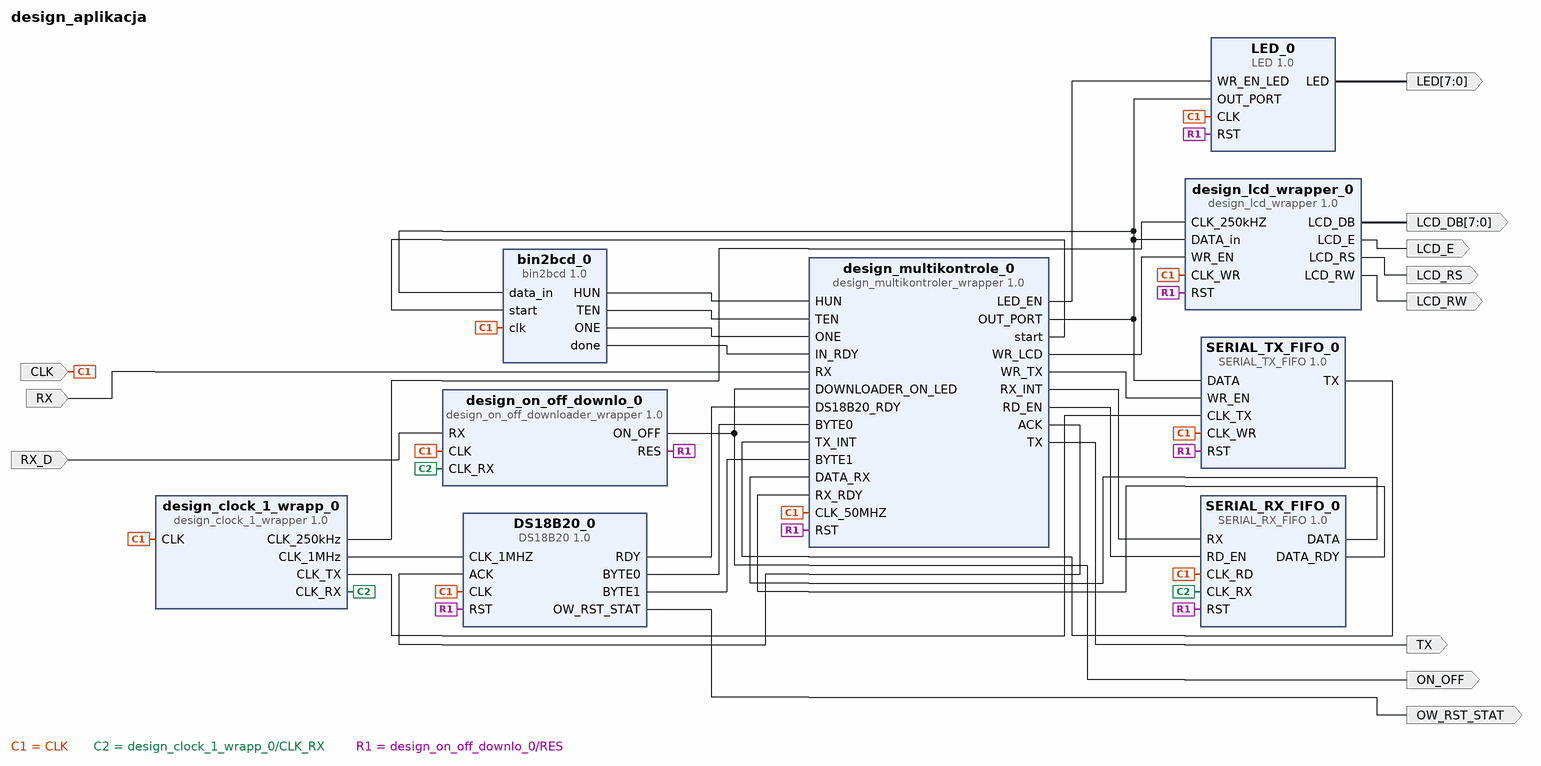
[diagram p0: block diagram of the top level]
# Vivado block design design_aplikacja, xc7z020clg400-2, Vivado 2019.1
create_bd_design design_aplikacja

create_bd_port -dir O -from 7 -to 0 LED
create_bd_port -dir I -type clk CLK
set_property -dict {CONFIG.FREQ_HZ 50000000} [get_bd_ports CLK]
create_bd_port -dir O ON_OFF
create_bd_port -dir O TX
create_bd_port -dir I RX
create_bd_port -dir I RX_D
create_bd_port -dir O -from 7 -to 0 LCD_DB
create_bd_port -dir O LCD_E
create_bd_port -dir O LCD_RS
create_bd_port -dir O LCD_RW
create_bd_port -dir O OW_RST_STAT

create_bd_cell -type ip -vlnv xilinx.com:user:design_multikontroler_wrapper:1.0 design_multikontrole_0
create_bd_cell -type ip -vlnv xilinx.com:user:design_on_off_downloader_wrapper:1.0 design_on_off_downlo_0
create_bd_cell -type ip -vlnv xilinx.com:user:bin2bcd:1.0 bin2bcd_0
create_bd_cell -type ip -vlnv xilinx.com:user:SERIAL_RX_FIFO:1.0 SERIAL_RX_FIFO_0
create_bd_cell -type ip -vlnv xilinx.com:user:SERIAL_TX_FIFO:1.0 SERIAL_TX_FIFO_0
create_bd_cell -type ip -vlnv xilinx.com:user:LED:1.0 LED_0
create_bd_cell -type ip -vlnv xilinx.com:user:design_clock_1_wrapper:1.0 design_clock_1_wrapp_0
create_bd_cell -type ip -vlnv xilinx.com:user:DS18B20:1.0 DS18B20_0
create_bd_cell -type ip -vlnv xilinx.com:user:design_lcd_wrapper:1.0 design_lcd_wrapper_0

# ---- connections ----

connect_bd_net [get_bd_pins bin2bcd_0/HUN] [get_bd_pins design_multikontrole_0/HUN]
connect_bd_net [get_bd_pins bin2bcd_0/TEN] [get_bd_pins design_multikontrole_0/TEN]
connect_bd_net [get_bd_pins bin2bcd_0/ONE] [get_bd_pins design_multikontrole_0/ONE]
connect_bd_net [get_bd_pins LED_0/LED] [get_bd_ports LED]
connect_bd_net -net CLK_0_1 [get_bd_ports CLK] \
  [get_bd_pins bin2bcd_0/clk] [get_bd_pins SERIAL_RX_FIFO_0/CLK_RD] [get_bd_pins design_multikontrole_0/CLK_50MHZ] \
  [get_bd_pins LED_0/CLK] [get_bd_pins design_on_off_downlo_0/CLK] [get_bd_pins SERIAL_TX_FIFO_0/CLK_WR] \
  [get_bd_pins design_clock_1_wrapp_0/CLK] [get_bd_pins DS18B20_0/CLK] [get_bd_pins design_lcd_wrapper_0/CLK_WR]
connect_bd_net [get_bd_pins design_clock_1_wrapp_0/CLK_RX] [get_bd_pins SERIAL_RX_FIFO_0/CLK_RX] [get_bd_pins design_on_off_downlo_0/CLK_RX]
connect_bd_net [get_bd_pins design_clock_1_wrapp_0/CLK_TX] [get_bd_pins SERIAL_TX_FIFO_0/CLK_TX]
connect_bd_net [get_bd_pins design_clock_1_wrapp_0/CLK_250kHz] [get_bd_pins design_lcd_wrapper_0/CLK_250kHZ]
connect_bd_net [get_bd_pins design_clock_1_wrapp_0/CLK_1MHz] [get_bd_pins DS18B20_0/CLK_1MHZ]
connect_bd_net [get_bd_pins design_multikontrole_0/start] [get_bd_pins bin2bcd_0/start]
connect_bd_net [get_bd_pins design_multikontrole_0/OUT_PORT] \
  [get_bd_pins bin2bcd_0/data_in] [get_bd_pins LED_0/OUT_PORT] [get_bd_pins SERIAL_TX_FIFO_0/DATA] \
  [get_bd_pins design_lcd_wrapper_0/DATA_in]
connect_bd_net [get_bd_pins design_on_off_downlo_0/ON_OFF] [get_bd_ports ON_OFF] [get_bd_pins design_multikontrole_0/DOWNLOADER_ON_LED]
connect_bd_net [get_bd_pins design_multikontrole_0/WR_TX] [get_bd_pins SERIAL_TX_FIFO_0/WR_EN]
connect_bd_net [get_bd_pins design_multikontrole_0/LED_EN] [get_bd_pins LED_0/WR_EN_LED]
connect_bd_net [get_bd_pins design_multikontrole_0/WR_LCD] [get_bd_pins design_lcd_wrapper_0/WR_EN]
connect_bd_net [get_bd_pins design_multikontrole_0/TX] [get_bd_ports TX]
connect_bd_net -net RX_0_1 [get_bd_ports RX] [get_bd_pins design_multikontrole_0/RX]
connect_bd_net [get_bd_pins design_on_off_downlo_0/RES] \
  [get_bd_pins SERIAL_RX_FIFO_0/RST] [get_bd_pins design_multikontrole_0/RST] [get_bd_pins LED_0/RST] \
  [get_bd_pins SERIAL_TX_FIFO_0/RST] [get_bd_pins DS18B20_0/RST] [get_bd_pins design_lcd_wrapper_0/RST]
connect_bd_net -net RX_0_2 [get_bd_ports RX_D] [get_bd_pins design_on_off_downlo_0/RX]
connect_bd_net [get_bd_pins design_lcd_wrapper_0/LCD_DB] [get_bd_ports LCD_DB]
connect_bd_net [get_bd_pins design_lcd_wrapper_0/LCD_E] [get_bd_ports LCD_E]
connect_bd_net [get_bd_pins design_lcd_wrapper_0/LCD_RS] [get_bd_ports LCD_RS]
connect_bd_net [get_bd_pins design_lcd_wrapper_0/LCD_RW] [get_bd_ports LCD_RW]
connect_bd_net [get_bd_pins SERIAL_TX_FIFO_0/TX] [get_bd_pins design_multikontrole_0/TX_INT]
connect_bd_net [get_bd_pins DS18B20_0/RDY] [get_bd_pins design_multikontrole_0/DS18B20_RDY]
connect_bd_net [get_bd_pins DS18B20_0/BYTE0] [get_bd_pins design_multikontrole_0/BYTE0]
connect_bd_net [get_bd_pins DS18B20_0/BYTE1] [get_bd_pins design_multikontrole_0/BYTE1]
connect_bd_net [get_bd_pins DS18B20_0/OW_RST_STAT] [get_bd_ports OW_RST_STAT]
connect_bd_net [get_bd_pins SERIAL_RX_FIFO_0/DATA] [get_bd_pins design_multikontrole_0/DATA_RX]
connect_bd_net [get_bd_pins SERIAL_RX_FIFO_0/DATA_RDY] [get_bd_pins design_multikontrole_0/RX_RDY]
connect_bd_net [get_bd_pins design_multikontrole_0/RX_INT] [get_bd_pins SERIAL_RX_FIFO_0/RX]
connect_bd_net [get_bd_pins design_multikontrole_0/RD_EN] [get_bd_pins SERIAL_RX_FIFO_0/RD_EN]
connect_bd_net [get_bd_pins design_multikontrole_0/ACK] [get_bd_pins DS18B20_0/ACK]
connect_bd_net [get_bd_pins bin2bcd_0/done] [get_bd_pins design_multikontrole_0/IN_RDY]

validate_bd_design
save_bd_design
